# EAGLE schematic thermo_final (EAGLE 9.6.2)
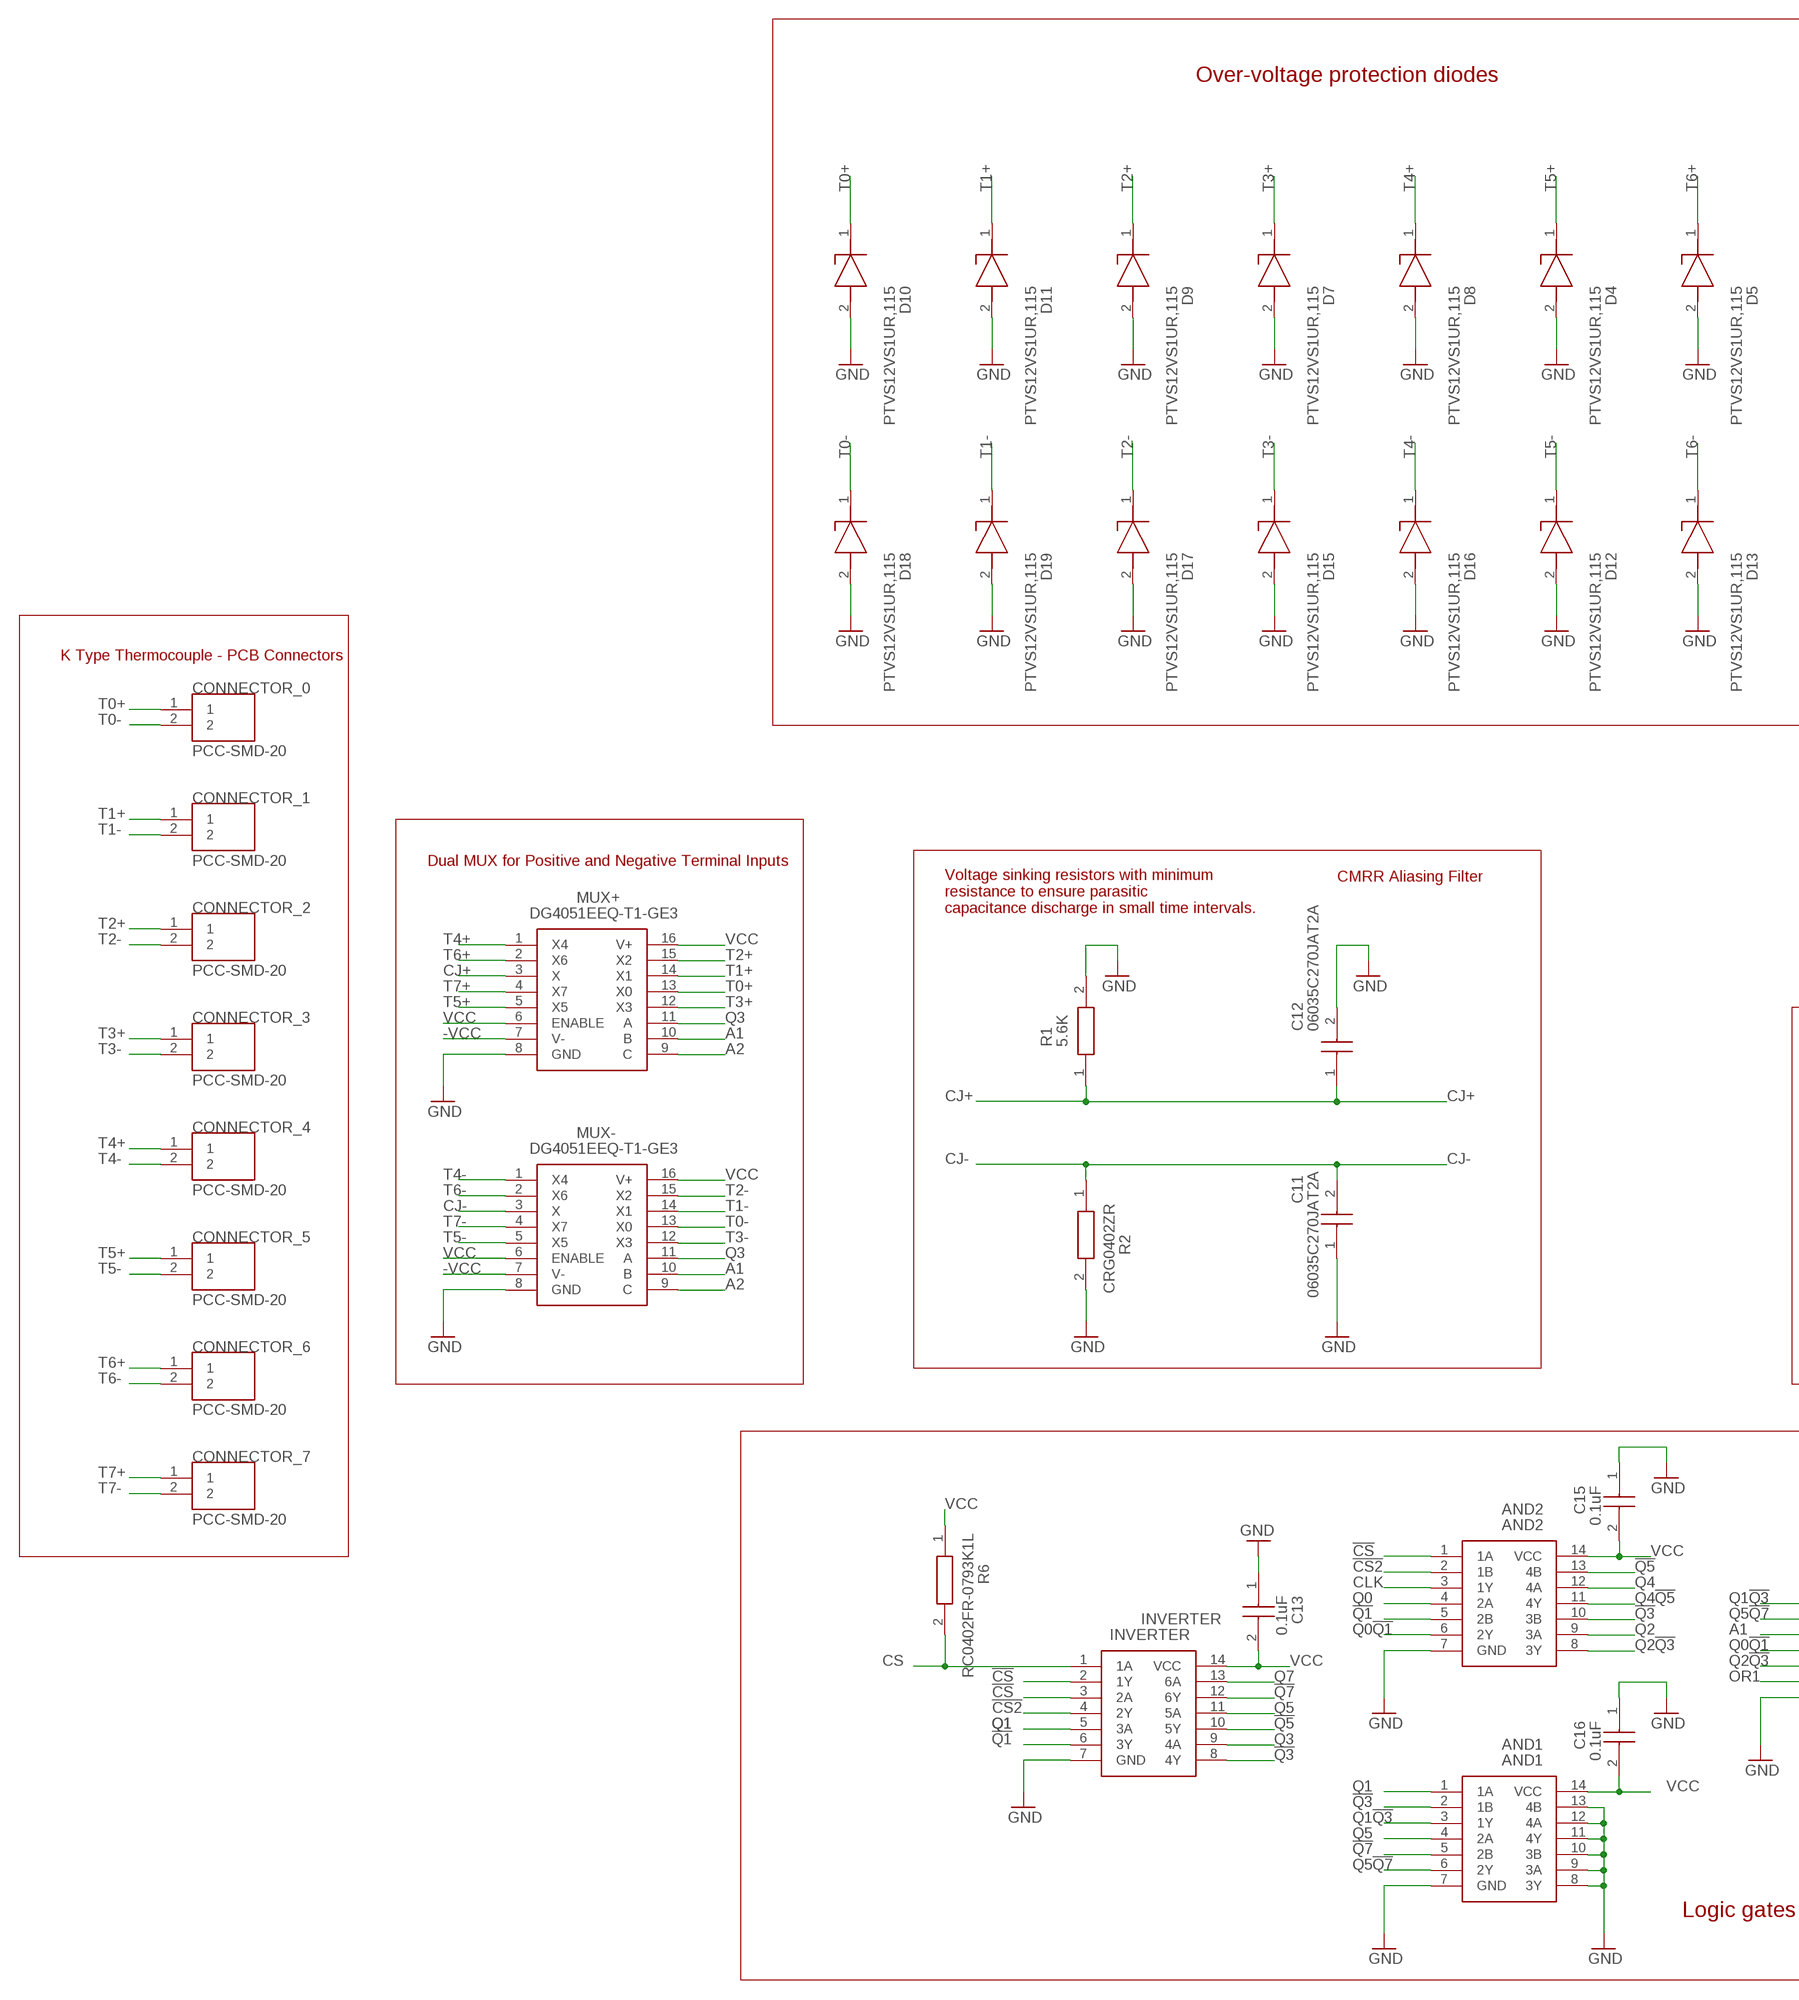
[diagram p0: schematic, sheet 1, part 1 of 2]
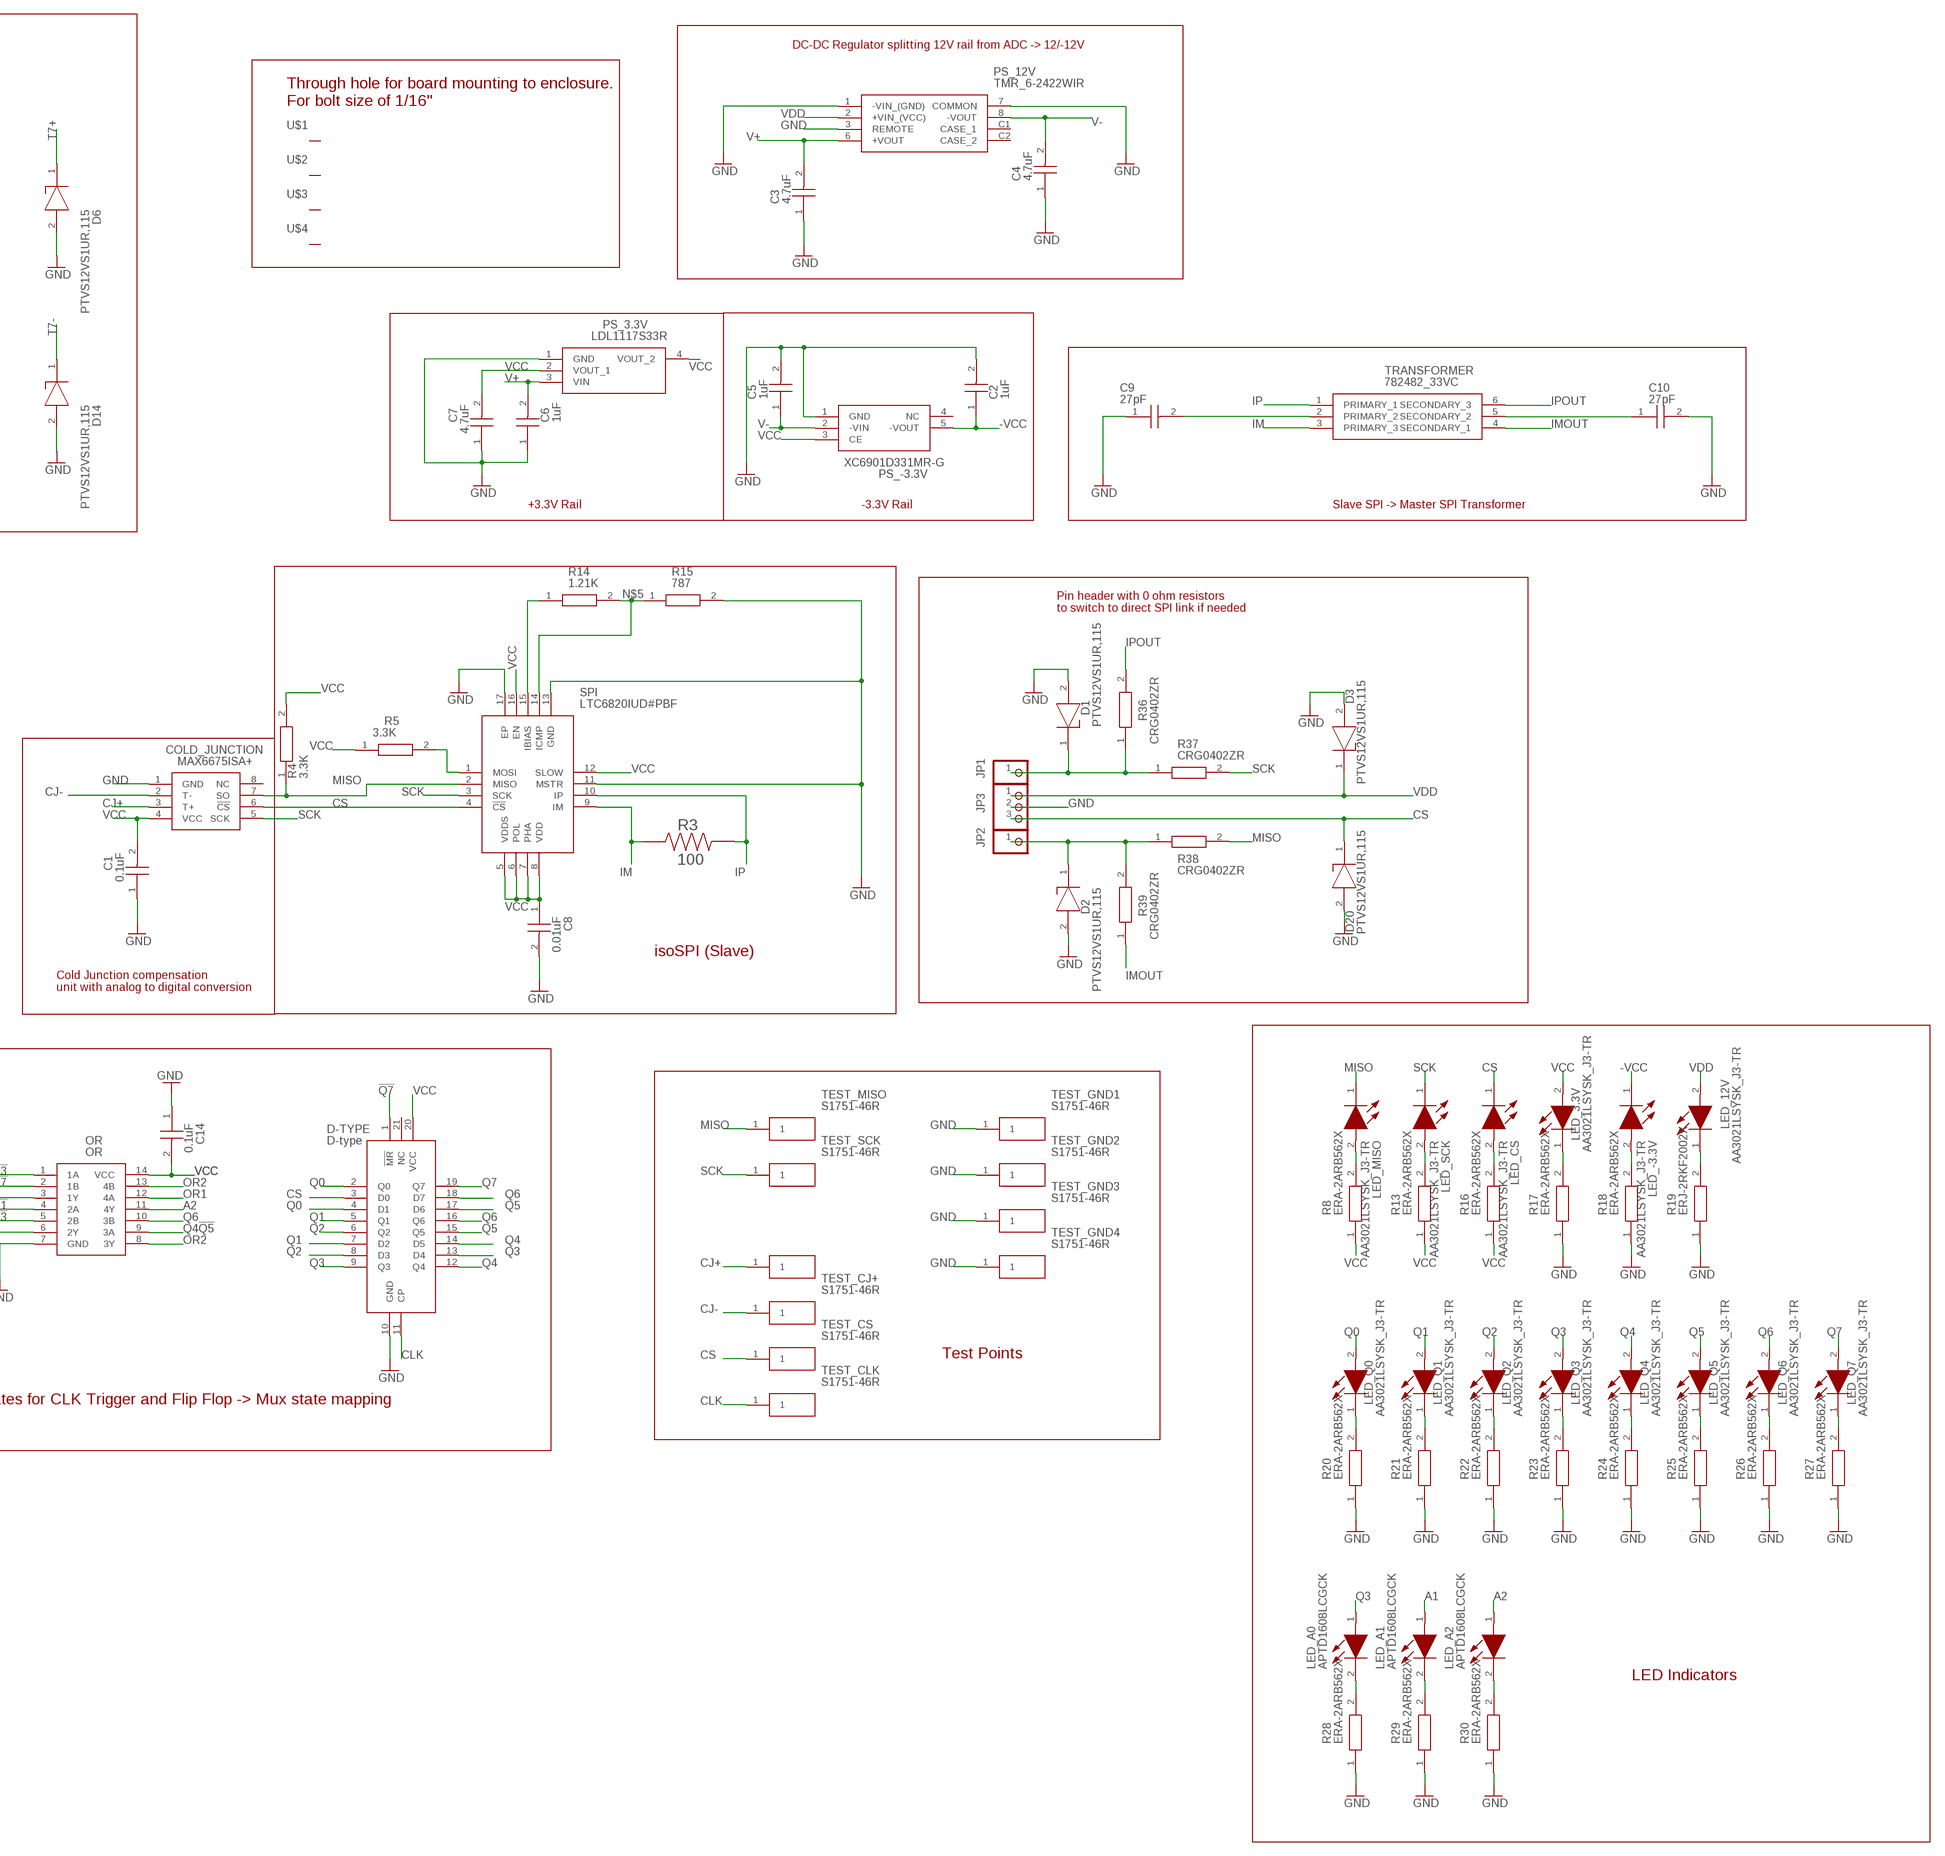
[diagram p1: schematic, sheet 1, part 2 of 2]

## Parts
AND1  AND1  SN74LVC08AMDREP  [SOIC127P600X175-14N]
AND2  AND2  SN74LVC08AMDREP  [SOIC127P600X175-14N]
C1  0.1uF  CGA3E2X7R1H104K080AE  [CAPC1608X90N]
C2  1uF  CGA3E1X7R1V105K080AC  [CAPC1608X90N]
C3  4.7uF  JMK107BB7475KA-T  [CAPC1608X90N]
C4  4.7uF  JMK107BB7475KA-T  [CAPC1608X90N]
C5  1uF  CGA3E1X7R1V105K080AC  [CAPC1608X90N]
C6  1uF  CGA3E1X7R1V105K080AC  [CAPC1608X90N]
C7  4.7uF  JMK107BB7475KA-T  [CAPC1608X90N]
C8  0.01uF  C0402C103J5RECAUTO  [CAPC1005X55N]
C9  27pF  06035C270JAT2A  [CAPC1608X90N]
C10  27pF  06035C270JAT2A  [CAPC1608X90N]
C11  06035C270JAT2A  [CAPC1608X90N]
C12  06035C270JAT2A  [CAPC1608X90N]
C13  0.1uF  CGA3E2X7R1H104K080AE  [CAPC1608X90N]
C14  0.1uF  CGA3E2X7R1H104K080AE  [CAPC1608X90N]
C15  0.1uF  CGA3E2X7R1H104K080AE  [CAPC1608X90N]
C16  0.1uF  CGA3E2X7R1H104K080AE  [CAPC1608X90N]
COLD_JUNCTION  MAX6675ISA+  [SOIC127P600X175-8N]
CONNECTOR_0  PCC-SMD-20  [OMEGA_PCC-SMD-20]
CONNECTOR_1  PCC-SMD-20  [OMEGA_PCC-SMD-20]
CONNECTOR_2  PCC-SMD-20  [OMEGA_PCC-SMD-20]
CONNECTOR_3  PCC-SMD-20  [OMEGA_PCC-SMD-20]
CONNECTOR_4  PCC-SMD-20  [OMEGA_PCC-SMD-20]
CONNECTOR_5  PCC-SMD-20  [OMEGA_PCC-SMD-20]
CONNECTOR_6  PCC-SMD-20  [OMEGA_PCC-SMD-20]
CONNECTOR_7  PCC-SMD-20  [OMEGA_PCC-SMD-20]
D1  PTVS12VS1UR,115  [SOD123W]
D2  PTVS12VS1UR,115  [SOD123W]
D3  PTVS12VS1UR,115  [SOD123W]
D4  PTVS12VS1UR,115  [SOD123W]
D5  PTVS12VS1UR,115  [SOD123W]
D6  PTVS12VS1UR,115  [SOD123W]
D7  PTVS12VS1UR,115  [SOD123W]
D8  PTVS12VS1UR,115  [SOD123W]
D9  PTVS12VS1UR,115  [SOD123W]
D10  PTVS12VS1UR,115  [SOD123W]
D11  PTVS12VS1UR,115  [SOD123W]
D12  PTVS12VS1UR,115  [SOD123W]
D13  PTVS12VS1UR,115  [SOD123W]
D14  PTVS12VS1UR,115  [SOD123W]
D15  PTVS12VS1UR,115  [SOD123W]
D16  PTVS12VS1UR,115  [SOD123W]
D17  PTVS12VS1UR,115  [SOD123W]
D18  PTVS12VS1UR,115  [SOD123W]
D19  PTVS12VS1UR,115  [SOD123W]
D20  PTVS12VS1UR,115  [SOD123W]
D-TYPE  D-type  74AHC273BQ,115  [QFN50P450X250X100-21N]
INVERTER  INVERTER  SN74HCS05QDRQ1  [SOIC127P600X175-14N]
JP1  PINHD-1X1  [1X01]
JP2  PINHD-1X1  [1X01]
JP3  PINHD-1X3  [1X03]
LED_3.3V  AA3021LSYSK_J3-TR  [AA3021LSYSKJ3TR]
LED_12V  AA3021LSYSK_J3-TR  [AA3021LSYSKJ3TR]
LED_-3.3V  AA3021LSYSK_J3-TR  [AA3021LSYSKJ3TR]
LED_A0  APTD1608LCGCK  [APT1608CGCK]
LED_A1  APTD1608LCGCK  [APT1608CGCK]
LED_A2  APTD1608LCGCK  [APT1608CGCK]
LED_CS  AA3021LSYSK_J3-TR  [AA3021LSYSKJ3TR]
LED_MISO  AA3021LSYSK_J3-TR  [AA3021LSYSKJ3TR]
LED_Q0  AA3021LSYSK_J3-TR  [AA3021LSYSKJ3TR]
LED_Q1  AA3021LSYSK_J3-TR  [AA3021LSYSKJ3TR]
LED_Q2  AA3021LSYSK_J3-TR  [AA3021LSYSKJ3TR]
LED_Q3  AA3021LSYSK_J3-TR  [AA3021LSYSKJ3TR]
LED_Q4  AA3021LSYSK_J3-TR  [AA3021LSYSKJ3TR]
LED_Q5  AA3021LSYSK_J3-TR  [AA3021LSYSKJ3TR]
LED_Q6  AA3021LSYSK_J3-TR  [AA3021LSYSKJ3TR]
LED_Q7  AA3021LSYSK_J3-TR  [AA3021LSYSKJ3TR]
LED_SCK  AA3021LSYSK_J3-TR  [AA3021LSYSKJ3TR]
MUX+  DG4051EEQ-T1-GE3  [SOP65P640X120-16N]
MUX-  DG4051EEQ-T1-GE3  [SOP65P640X120-16N]
OR  OR  SN74LV32ADE4  [SOIC127P600X175-14N]
PS_3.3V  LDL1117S33R  [SOT230P700X180-4N]
PS_12V  TMR_6-2422WIR  [TMR67212WIR]
PS_-3.3V  XC6901D331MR-G  [SOT95P280X130-5N]
R1  5.6K  ERA-2ARB562X  [ERA2AED122X]
R2  CRG0402ZR  [RESC1005X40N]
R3  100  TNPW0402100RBYEP  [RESC1005X40N]
R4  3.3K  RC0402JR-133K3L  [RESC1005X40N]
R5  3.3K  RC0402JR-133K3L  [RESC1005X40N]
R6  RC0402FR-0793K1L  [RESC1005X40N]
R8  ERA-2ARB562X  [ERA2AED122X]
R13  ERA-2ARB562X  [ERA2AED122X]
R14  1.21K  CPF0402B1K21E1  [RESC1005X35N]
R15  787  ERA-2AEB7870X  [ERA2AED122X]
R16  ERA-2ARB562X  [ERA2AED122X]
R17  ERA-2ARB562X  [ERA2AED122X]
R18  ERA-2ARB562X  [ERA2AED122X]
R19  ERJ-2RKF2002X  [ERJ2R_(0402)]
R20  ERA-2ARB562X  [ERA2AED122X]
R21  ERA-2ARB562X  [ERA2AED122X]
R22  ERA-2ARB562X  [ERA2AED122X]
R23  ERA-2ARB562X  [ERA2AED122X]
R24  ERA-2ARB562X  [ERA2AED122X]
R25  ERA-2ARB562X  [ERA2AED122X]
R26  ERA-2ARB562X  [ERA2AED122X]
R27  ERA-2ARB562X  [ERA2AED122X]
R28  ERA-2ARB562X  [ERA2AED122X]
R29  ERA-2ARB562X  [ERA2AED122X]
R30  ERA-2ARB562X  [ERA2AED122X]
R36  CRG0402ZR  [RESC1005X40N]
R37  CRG0402ZR  [RESC1005X40N]
R38  CRG0402ZR  [RESC1005X40N]
R39  CRG0402ZR  [RESC1005X40N]
SPI  LTC6820IUD#PBF  [QFN50P300X300X80-17N]
TEST_CJ+  S1751-46R  [S175146R]
TEST_CJ-  S1751-46R  [S175146R]
TEST_CLK  S1751-46R  [S175146R]
TEST_CS  S1751-46R  [S175146R]
TEST_GND1  S1751-46R  [S175146R]
TEST_GND2  S1751-46R  [S175146R]
TEST_GND3  S1751-46R  [S175146R]
TEST_GND4  S1751-46R  [S175146R]
TEST_MISO  S1751-46R  [S175146R]
TEST_SCK  S1751-46R  [S175146R]
TRANSFORMER  782482_33VC  [DIP1016W60P254L914H635Q6N]
U$1  THROUGH_HOLE  [THROUGH_HOLE]
U$2  THROUGH_HOLE  [THROUGH_HOLE]
U$3  THROUGH_HOLE  [THROUGH_HOLE]
U$4  THROUGH_HOLE  [THROUGH_HOLE]

## Nets
!CS: AND2.1(1A) INVERTER.2(1Y) INVERTER.3(2A)
!CS2: AND2.2(1B) INVERTER.4(2Y)
!Q1: AND2.5(2B) INVERTER.6(3Y)
!Q3: AND1.2(1B) AND2.10(3B) INVERTER.8(4Y)
!Q5: AND2.13(4B) INVERTER.10(5Y)
!Q7: AND1.5(2B) D-TYPE.1(!MR) INVERTER.12(6Y)
-VCC: C2.1 LED_-3.3V.1(K) MUX+.7(V-) MUX-.7(V-) PS_-3.3V.5(-VOUT)
A1: LED_A1.1(A) MUX+.10(B) MUX-.10(B) OR.3(1Y)
A2: LED_A2.1(A) MUX+.9(C) MUX-.9(C) OR.11(4Y)
CJ+: C12.1 COLD_JUNCTION.3(T+) MUX+.3(X) R1.1 TEST_CJ-.1
CJ-: C11.2 COLD_JUNCTION.2(T-) MUX-.3(X) R2.1 TEST_CJ+.1
CLK: AND2.3(1Y) D-TYPE.11(CP) TEST_CLK.1
CS: COLD_JUNCTION.6(!CS) D20.1(K) D-TYPE.3(D0) INVERTER.1(1A) JP3.3 LED_CS.1(K) R6.2 SPI.4(!CS) TEST_CS.1
GND: AND1.7(GND) AND1.8(3Y) AND1.9(3A) AND1.10(3B) AND1.11(4Y) AND1.12(4A) AND1.13(4B) AND2.7(GND) C1.1 C2.2 C3.1 C4.1 C5.2 C6.1 C7.1 C8.2 C9.1 C10.2 C11.1 C12.2 C13.1 C14.1 C15.1 C16.1 COLD_JUNCTION.1(GND) D1.2(A) D2.2(A) D3.2(A) D4.2(A) D5.2(A) D6.2(A) D7.2(A) D8.2(A) D9.2(A) D10.2(A) D11.2(A) D12.2(A) D13.2(A) D14.2(A) D15.2(A) D16.2(A) D17.2(A) D18.2(A) D19.2(A) D20.2(A) D-TYPE.10(GND) INVERTER.7(GND) JP3.2 MUX+.8(GND) MUX-.8(GND) OR.7(GND) PS_3.3V.1(GND) PS_12V.1(-VIN_(GND)) PS_12V.3(REMOTE) PS_12V.7(COMMON) PS_-3.3V.1(GND) R1.2 R2.2 R15.2 R17.1 R18.1 R19.1 R20.1 R21.1 R22.1 R23.1 R24.1 R25.1 R26.1 R27.1 R28.1 R29.1 R30.1 SPI.11(MSTR) SPI.13(GND) SPI.17(EP) TEST_GND1.1 TEST_GND2.1 TEST_GND3.1 TEST_GND4.1
IM: R3.1 SPI.9(IM) TRANSFORMER.3(PRIMARY_3)
IMOUT: R39.1 TRANSFORMER.4(SECONDARY_1)
IP: R3.2 SPI.10(IP) TRANSFORMER.1(PRIMARY_1)
IPOUT: R36.2 TRANSFORMER.6(SECONDARY_3)
MISO: COLD_JUNCTION.7(SO) LED_MISO.1(K) R4.1 R38.2 SPI.2(MISO) TEST_MISO.1
N$2: LED_12V.1(K) R19.2
N$5: R14.2 R15.1 SPI.14(ICMP)
N$7: LED_Q0.1(K) R20.2
N$10: C9.2 TRANSFORMER.2(PRIMARY_2)
N$11: R14.1 SPI.15(IBIAS)
N$12: LED_Q1.1(K) R21.2
N$14: C10.1 TRANSFORMER.5(SECONDARY_2)
N$16: LED_Q2.1(K) R22.2
N$17: LED_Q3.1(K) R23.2
N$20: LED_MISO.2(A) R8.2
N$22: R5.2 SPI.1(MOSI)
N$23: LED_SCK.2(A) R13.2
N$24: LED_CS.2(A) R16.2
N$25: LED_3.3V.1(K) R17.2
N$26: LED_-3.3V.2(A) R18.2
N$27: LED_Q4.1(K) R24.2
N$28: LED_Q5.1(K) R25.2
N$29: LED_Q6.1(K) R26.2
N$30: LED_Q7.1(K) R27.2
N$34: LED_A0.2(K) R28.2
N$35: LED_A1.2(K) R29.2
N$36: LED_A2.2(K) R30.2
N$37: D1.1(K) JP1.1 R36.1 R37.1
N$40: D2.1(K) JP2.1 R38.1 R39.2
OR1: OR.6(2Y) OR.12(4A)
OR2: OR.8(3Y) OR.13(4B)
Q0: AND2.4(2A) D-TYPE.2(Q0) D-TYPE.4(D1) LED_Q0.2(A)
Q0!Q1: AND2.6(2Y) OR.4(2A)
Q1: AND1.1(1A) D-TYPE.5(Q1) D-TYPE.7(D2) INVERTER.5(3A) LED_Q1.2(A)
Q1!Q3: AND1.3(1Y) OR.1(1A)
Q2: AND2.9(3A) D-TYPE.6(Q2) D-TYPE.8(D3) LED_Q2.2(A)
Q2!Q3: AND2.8(3Y) OR.5(2B)
Q3: D-TYPE.9(Q3) D-TYPE.13(D4) INVERTER.9(4A) LED_A0.1(A) LED_Q3.2(A) MUX+.11(A) MUX-.11(A)
Q4: AND2.12(4A) D-TYPE.12(Q4) D-TYPE.14(D5) LED_Q4.2(A)
Q4!Q5: AND2.11(4Y) OR.9(3A)
Q5: AND1.4(2A) D-TYPE.15(Q5) D-TYPE.17(D6) INVERTER.11(5A) LED_Q5.2(A)
Q5!Q7: AND1.6(2Y) OR.2(1B)
Q6: D-TYPE.16(Q6) D-TYPE.18(D7) LED_Q6.2(A) OR.10(3B)
Q7: D-TYPE.19(Q7) INVERTER.13(6A) LED_Q7.2(A)
SCK: COLD_JUNCTION.5(SCK) LED_SCK.1(K) R37.2 SPI.3(SCK) TEST_SCK.1
T0+: CONNECTOR_0.1 D10.1(K) MUX+.13(X0)
T0-: CONNECTOR_0.2 D18.1(K) MUX-.13(X0)
T1+: CONNECTOR_1.1 D11.1(K) MUX+.14(X1)
T1-: CONNECTOR_1.2 D19.1(K) MUX-.14(X1)
T2+: CONNECTOR_2.1 D9.1(K) MUX+.15(X2)
T2-: CONNECTOR_2.2 D17.1(K) MUX-.15(X2)
T3+: CONNECTOR_3.1 D7.1(K) MUX+.12(X3)
T3-: CONNECTOR_3.2 D15.1(K) MUX-.12(X3)
T4+: CONNECTOR_4.1 D8.1(K) MUX+.1(X4)
T4-: CONNECTOR_4.2 D16.1(K) MUX-.1(X4)
T5+: CONNECTOR_5.1 D4.1(K) MUX+.5(X5)
T5-: CONNECTOR_5.2 D12.1(K) MUX-.5(X5)
T6+: CONNECTOR_6.1 D5.1(K) MUX+.2(X6)
T6-: CONNECTOR_6.2 D13.1(K) MUX-.2(X6)
T7+: CONNECTOR_7.1 D6.1(K) MUX+.4(X7)
T7-: CONNECTOR_7.2 D14.1(K) MUX-.4(X7)
V+: C3.2 C6.2 PS_3.3V.3(VIN) PS_12V.6(+VOUT)
V-: C4.2 C5.1 PS_12V.8(-VOUT) PS_-3.3V.2(-VIN)
VCC: AND1.14(VCC) AND2.14(VCC) C1.2 C7.2 C8.1 C13.2 C14.2 C15.2 C16.2 COLD_JUNCTION.4(VCC) D-TYPE.20(VCC) INVERTER.14(VCC) LED_3.3V.2(A) MUX+.6(ENABLE) MUX+.16(V+) MUX-.6(ENABLE) MUX-.16(V+) OR.14(VCC) PS_3.3V.2(VOUT_1) PS_3.3V.4(VOUT_2) PS_-3.3V.3(CE) R4.2 R5.1 R6.1 R8.1 R13.1 R16.1 SPI.5(VDDS) SPI.6(POL) SPI.7(PHA) SPI.8(VDD) SPI.12(SLOW) SPI.16(EN)
VDD: D3.1(K) JP3.1 LED_12V.2(A) PS_12V.2(+VIN_(VCC))
Unconnected: COLD_JUNCTION.8(NC) D-TYPE.21(NC) PS_12V.C1(CASE_1) PS_12V.C2(CASE_2) PS_-3.3V.4(NC) U$1.THROUGH_HOLE U$2.THROUGH_HOLE U$3.THROUGH_HOLE U$4.THROUGH_HOLE

## Notes on the sheet
- DC-DC Regulator splitting 12V rail from ADC -> 12/-12V
- Over-voltage protection diodes
- Through hole for board mounting to enclosure.
  For bolt size of 1/16"
- K Type Thermocouple - PCB Connectors
- +3.3V Rail | -3.3V Rail | Slave SPI -> Master SPI Transformer
- Pin header with 0 ohm resistors
  to switch to direct SPI link if needed
- Dual MUX for Positive and Negative Terminal Inputs
- CMRR Aliasing Filter
- Voltage sinking resistors with minimum
  resistance to ensure parasitic 
  capacitance discharge in small time intervals.
- isoSPI (Slave)
- Cold Junction compensation 
  unit with analog to digital conversion
- Test Points
- Logic gates for CLK Trigger and Flip Flop -> Mux state mapping
- LED Indicators

## Library data of the parts
AND1 AND2 = SamacSys_Parts:SN74LVC08AMDREP: Enhanced Product Quadruple 2-Input Positive-And Gate Source: Datasheet <http://www.ti.com/lit/gpn/sn74lvc08a-ep>; DESCRIPTION: Enhanced Product Quadruple 2-Input Positive-And Gate; HEIGHT: 1.75mm; MANUFACTURER_NAME: Texas Instruments; MANUFACTURER_PART_NUMBER: SN74LVC08AMDREP; MOUSER_PART_NUMBER: 595-SN74LVC08AMDREP; MOUSER_PRICE-STOCK: https://www.mouser.co.uk/ProductDetail/Texas-Instruments/SN74LVC08AMDREP?qs=IUbkBnfnSQJ8S345Etgw0g%3D%3D
C1 C13-C16 = SamacSys_Parts:CGA3E2X7R1H104K080AE: Multilayer Ceramic Chip Capacitors, Capacitance=0.1uF, LxWxT:1.6x0.8x0.8mm Source: Datasheet <https://product.tdk.com/system/files/dam/doc/product/capacitor/ceramic/mlcc/catalog/mlcc_automotive_soft_en.pdf>; DESCRIPTION: Multilayer Ceramic Chip Capacitors, Capacitance=0.1uF, LxWxT:1.6x0.8x0.8mm; HEIGHT: 0.9mm; MANUFACTURER_NAME: TDK; MANUFACTURER_PART_NUMBER: CGA3E2X7R1H104K080AE; MOUSER_PART_NUMBER: 810-CGA3E2X7R1H104KE; MOUSER_PRICE-STOCK: https://www.mouser.co.uk/ProductDetail/TDK/CGA3E2X7R1H104K080AE?qs=n%2FVzw7c4a0kvajqFvEbDzQ%3D%3D
C2 C5 C6 = SamacSys_Parts:CGA3E1X7R1V105K080AC: Multilayer Ceramic Capacitors MLCC - SMD/SMT 0603 1uF 35volts X7R 10% T=0.8mm Source: Datasheet <https://product.tdk.com/system/files/dam/doc/product/capacitor/ceramic/mlcc/catalog/mlcc_automotive_general_en.pdf>; DESCRIPTION: Multilayer Ceramic Capacitors MLCC - SMD/SMT 0603 1uF 35volts X7R 10% T=0.8mm; HEIGHT: 0.9mm; MANUFACTURER_NAME: TDK; MANUFACTURER_PART_NUMBER: CGA3E1X7R1V105K080AC; MOUSER_PART_NUMBER: 810-CGA3E1X7R1V105KC; MOUSER_PRICE-STOCK: https://www.mouser.co.uk/ProductDetail/TDK/CGA3E1X7R1V105K080AC?qs=xLDY6iXSiQbKOisZZVHFrA%3D%3D
C3 C4 C7 = SamacSys_Parts:JMK107BB7475KA-T: Taiyo Yuden JMK107BB7475KA-T 4.7F MLCC 6.3V dc +/-10% Tolerance SMD Source: Datasheet <https://componentsearchengine.com/Datasheets/1/JMK107BB7475KA-T.pdf>; DESCRIPTION: Taiyo Yuden JMK107BB7475KA-T 4.7F MLCC 6.3V dc +/-10% Tolerance SMD; HEIGHT: 0.9mm; MANUFACTURER_NAME: TAIYO YUDEN; MANUFACTURER_PART_NUMBER: JMK107BB7475KA-T; MOUSER_PART_NUMBER: 963-JMK107BB7475KA-T; MOUSER_PRICE-STOCK: https://www.mouser.co.uk/ProductDetail/Taiyo-Yuden/JMK107BB7475KA-T/?qs=Va%252BXcMGJzEswq6AuVGoq3Q%3D%3D
C8 = SamacSys_Parts:C0402C103J5RECAUTO: Multilayer Ceramic Capacitors MLCC - SMD/SMT 50V 0.01uF X7R 0402 5% AEC-Q200 Source: Datasheet <https://componentsearchengine.com/Datasheets/1/C0402C103J5RECAUTO.pdf>; DESCRIPTION: Multilayer Ceramic Capacitors MLCC - SMD/SMT 50V 0.01uF X7R 0402 5% AEC-Q200; HEIGHT: 0.55mm; MANUFACTURER_NAME: Kemet; MANUFACTURER_PART_NUMBER: C0402C103J5RECAUTO; MOUSER_PART_NUMBER: 80-C0402C103J5RECAUT; MOUSER_PRICE-STOCK: https://www.mouser.com/Search/Refine.aspx?Keyword=80-C0402C103J5RECAUT
C9-C12 = SamacSys_Parts:06035C270JAT2A: Capacitor, 0603 27PF +/-5% 50V Source: Datasheet <https://componentsearchengine.com/Datasheets/1/06031A100FAT2A.pdf>; DESCRIPTION: Capacitor, 0603 27PF +/-5% 50V; HEIGHT: 0.9mm; MANUFACTURER_NAME: AVX; MANUFACTURER_PART_NUMBER: 06035C270JAT2A
COLD_JUNCTION = SamacSys_Parts:MAX6675ISA+: MAX6675ISA+, 12bit Temperature Sensor +/-6C Serial-SPI 3 to 5.5V 8-Pin SOIC Source: Datasheet <http://datasheets.maximintegrated.com/en/ds/MAX6675.pdf>; DESCRIPTION: MAX6675ISA+, 12bit Temperature Sensor +/-6C Serial-SPI 3 to 5.5V 8-Pin SOIC; HEIGHT: 1.75mm; MANUFACTURER_NAME: Maxim Integrated; MANUFACTURER_PART_NUMBER: MAX6675ISA+; MOUSER_PART_NUMBER: 700-MAX6675ISA; MOUSER_PRICE-STOCK: https://www.mouser.co.uk/ProductDetail/Maxim-Integrated/MAX6675ISA%2b?qs=1THa7WoU59H74vpgspkIMw%3D%3D
CONNECTOR_0 CONNECTOR_1-CONNECTOR_7 = SamacSys_Parts:PCC-SMD-20: Circuit Board Thermocouple Connectors For Miniature Connectors Check availability <https://pricing.snapeda.com/parts/PCC-SMD-20/Omega%20Engineering/view-part?ref=eda>; AVAILABILITY: In Stock; DESCRIPTION: Circuit Board Thermocouple Connectors For Miniature Connectors; MF: Omega Engineering; MP: PCC-SMD-20; PACKAGE: Package; PRICE: None
D1-D20 = SamacSys_Parts:PTVS12VS1UR,115: PTVSxS1UR series - 400 W Transient Voltage Suppressor Source: Datasheet <https://assets.nexperia.com/documents/data-sheet/PTVSXS1UR_SER.pdf>; DESCRIPTION: PTVSxS1UR series - 400 W Transient Voltage Suppressor; HEIGHT: mm; MANUFACTURER_NAME: Nexperia; MANUFACTURER_PART_NUMBER: PTVS12VS1UR,115; MOUSER_PART_NUMBER: 771-PTVS12VS1UR115; MOUSER_PRICE-STOCK: https://www.mouser.co.uk/ProductDetail/Nexperia/PTVS12VS1UR115?qs=LMSg3oBIm%2FiWSHvsyxWiLg%3D%3D
D-TYPE = SamacSys_Parts:74AHC273BQ,115: 74AHC(T)273 - Octal D-type flip-flop with reset; positive-edge trigger@en-us Source: Datasheet <https://assets.nexperia.com/documents/data-sheet/74AHC_AHCT273.pdf>; DESCRIPTION: 74AHC(T)273 - Octal D-type flip-flop with reset; positive-edge trigger@en-us; HEIGHT: 1mm; MANUFACTURER_NAME: Nexperia; MANUFACTURER_PART_NUMBER: 74AHC273BQ,115; MOUSER_PART_NUMBER: 771-AHC273BQ115; MOUSER_PRICE-STOCK: https://www.mouser.co.uk/ProductDetail/Nexperia/74AHC273BQ115?qs=P62ublwmbi%2FNeDtynP3YzQ%3D%3D
INVERTER = SamacSys_Parts:SN74HCS05QDRQ1: Inverters Automotive hex inverters with open-drain outputs Source: Datasheet <https://datasheet.datasheetarchive.com/originals/distributors/Datasheets_SAMA/e44fd63c1eea9119ffad112a4354263c.pdf>; DESCRIPTION: Inverters Automotive hex inverters with open-drain outputs; HEIGHT: 1.75mm; MANUFACTURER_NAME: Texas Instruments; MANUFACTURER_PART_NUMBER: SN74HCS05QDRQ1; MOUSER_PART_NUMBER: 595-SN74HCS05QDRQ1; MOUSER_PRICE-STOCK: https://www.mouser.co.uk/ProductDetail/Texas-Instruments/SN74HCS05QDRQ1?qs=wnTfsH77Xs5yXbtYXA5ARw%3D%3D
JP1 JP2 = pinhead:PINHD-1X1: PIN HEADER
JP3 = pinhead:PINHD-1X3: PIN HEADER
LED_3.3V LED_12V LED_-3.3V LED_CS LED_MISO LED_Q0 LED_Q1-LED_Q7 LED_SCK = SamacSys_Parts:AA3021LSYSK_J3-TR: Standard LEDs - SMD 3mmX2mm SMD LED LAMP SB YELLOW Source: Datasheet <https://eagle.componentsearchengine.com/Datasheets/1/AA3021LSYSK_J3-TR.pdf>; DESCRIPTION: Standard LEDs - SMD 3mmX2mm SMD LED LAMP SB YELLOW; HEIGHT: 1.3mm; MANUFACTURER_NAME: Kingbright; MANUFACTURER_PART_NUMBER: AA3021LSYSK/J3-TR; MOUSER_PART_NUMBER: 604-AA3021LSYSK/J3TR; MOUSER_PRICE-STOCK: https://www.mouser.co.uk/ProductDetail/Kingbright/AA3021LSYSK-J3-TR?qs=Oo40KB9lBTmS1V8p5PSO3Q%3D%3D
LED_A0 LED_A1 LED_A2 = SamacSys_Parts:APTD1608LCGCK: Standard LEDs - SMD 0603 Dome Lens LED Green- 570nm Source: Datasheet; DESCRIPTION: Standard LEDs - SMD 0603 Dome Lens LED Green- 570nm; HEIGHT: mm; MANUFACTURER_NAME: Kingbright; MANUFACTURER_PART_NUMBER: APTD1608LCGCK; MOUSER_PART_NUMBER: 604-APTD1608LCGCK; MOUSER_PRICE-STOCK: https://www.mouser.co.uk/ProductDetail/Kingbright/APTD1608LCGCK?qs=AQlKX63v8Rv%252Bp7eo1xBjCA%3D%3D
MUX+ MUX- = SamacSys_Parts:DG4051EEQ-T1-GE3: VISHAY - DG4051EEQ-T1-GE3 - ANALOGUE MUX, 1 CH, 8:1, TSSOP-16 Source: Datasheet <https://www.vishay.com/docs/69685/dg4051e.pdf>; DESCRIPTION: VISHAY - DG4051EEQ-T1-GE3 - ANALOGUE MUX, 1 CH, 8:1, TSSOP-16; HEIGHT: 1.2mm; MANUFACTURER_NAME: Vishay; MANUFACTURER_PART_NUMBER: DG4051EEQ-T1-GE3; MOUSER_PART_NUMBER: 78-DG4051EEQ-T1-GE3; MOUSER_PRICE-STOCK: https://www.mouser.co.uk/ProductDetail/Vishay-Siliconix/DG4051EEQ-T1-GE3?qs=367PjNmvCmmPtnHZ5hoXyA%3D%3D
OR = SamacSys_Parts:SN74LV32ADE4: Logic Gates Quadruple 2-Input Positive-OR Gates Source: Datasheet <https://www.ti.com/lit/gpn/sn74lv32a>; DESCRIPTION: Logic Gates Quadruple 2-Input Positive-OR Gates; HEIGHT: 1.75mm; MANUFACTURER_NAME: Texas Instruments; MANUFACTURER_PART_NUMBER: SN74LV32ADE4; MOUSER_PART_NUMBER: 595-SN74LV32ADE4; MOUSER_PRICE-STOCK: https://www.mouser.co.uk/ProductDetail/Texas-Instruments/SN74LV32ADE4?qs=UG%2F8xqv%2F6Wd6nyqQSVzDrA%3D%3D
PS_3.3V = SamacSys_Parts:LDL1117S33R: STMICROELECTRONICS - LDL1117S33R - LDO, FIXED, 3.3V, 1.2A, SOT-223-3 Source: Datasheet <https://componentsearchengine.com/Datasheets/2/LDL1117S33R.pdf>; DESCRIPTION: STMICROELECTRONICS - LDL1117S33R - LDO, FIXED, 3.3V, 1.2A, SOT-223-3; HEIGHT: 1.8mm; MANUFACTURER_NAME: STMicroelectronics; MANUFACTURER_PART_NUMBER: LDL1117S33R; MOUSER_PART_NUMBER: 511-LDL1117S33R; MOUSER_PRICE-STOCK: https://www.mouser.co.uk/ProductDetail/STMicroelectronics/LDL1117S33R?qs=AQlKX63v8Rt9Bf6AWSrbFg%3D%3D
PS_12V = SamacSys_Parts:TMR_6-2422WIR: 6 Watt DC/DC converter, railway, 4:1 input incl. 110 VDC nominal, regulated, 3000 VDC I/O-isolation, encapsulated, SIP-8 metal case Source: Datasheet <https://tracopower.com/tmr6wir-datasheet/>; DESCRIPTION: 6 Watt DC/DC converter, railway, 4:1 input incl. 110 VDC nominal, regulated, 3000 VDC I/O-isolation, encapsulated, SIP-8 metal case; HEIGHT: 11.7mm; MANUFACTURER_NAME: Traco Power; MANUFACTURER_PART_NUMBER: TMR 6-2422WIR; MOUSER_PART_NUMBER: 495-TMR6-2422WIR; MOUSER_PRICE-STOCK: https://www.mouser.co.uk/ProductDetail/TRACO-Power/TMR-6-2422WIR?qs=y6ZabgHbY%252BxPUL%252BjE2kWEQ%3D%3D
PS_-3.3V = SamacSys_Parts:XC6901D331MR-G: TOREX - XC6901D331MR-G - LDO Voltage Regulator, Fixed, -12.4 V to -2.4 V in, 102 mV Drop, -3.3 V/200 mA out, SOT-25-5 Source: Datasheet <https://ms.componentsearchengine.com/Datasheets/2/XC6901D331MR-G.pdf>; DESCRIPTION: TOREX - XC6901D331MR-G - LDO Voltage Regulator, Fixed, -12.4 V to -2.4 V in, 102 mV Drop, -3.3 V/200 mA out, SOT-25-5; HEIGHT: 1.3mm; MANUFACTURER_NAME: Torex; MANUFACTURER_PART_NUMBER: XC6901D331MR-G; MOUSER_PART_NUMBER: 865-XC6901D331MR-G; MOUSER_PRICE-STOCK: https://www.mouser.co.uk/ProductDetail/Torex-Semiconductor/XC6901D331MR-G/?qs=AsjdqWjXhJ%2FQIk2kdQmgqw%3D%3D
R1 R8 R13 R16-R18 R20-R30 = SamacSys_Parts:ERA-2ARB562X: Metal Thin Film Chip Resistor, 0402, 0.063W Source: Datasheet <https://componentsearchengine.com/Datasheets/1/ERA-2ARB562X.pdf>; DESCRIPTION: Metal Thin Film Chip Resistor, 0402, 0.063W; HEIGHT: 0.4mm; MANUFACTURER_NAME: Panasonic; MANUFACTURER_PART_NUMBER: ERA-2ARB562X; MOUSER_PART_NUMBER: 667-ERA-2ARB562X; MOUSER_PRICE-STOCK: https://www.mouser.com/Search/Refine.aspx?Keyword=667-ERA-2ARB562X
R2 R36-R39 = SamacSys_Parts:CRG0402ZR: 0 0402 Thick Film Surface Mount Fixed Resistor +/-0% 0.063W CRG0402ZR Source: Datasheet <https://www.te.com/commerce/DocumentDelivery/DDEController?Action=showdoc&DocId=Data Sheet1773204JpdfEnglishENG_DS_1773204_J.pdf6-1622826-4>; DESCRIPTION: 0 0402 Thick Film Surface Mount Fixed Resistor +/-0% 0.063W CRG0402ZR; HEIGHT: 0.4mm; MANUFACTURER_NAME: TE Connectivity; MANUFACTURER_PART_NUMBER: CRG0402ZR; MOUSER_PART_NUMBER: 279-CRG0402ZR; MOUSER_PRICE-STOCK: https://www.mouser.co.uk/ProductDetail/TE-Connectivity-Holsworthy/CRG0402ZR?qs=n4i9pByFsMS7bfq5JAG5yw%3D%3D
R3 = SamacSys_Parts:TNPW0402100RBYEP: Check availability <https://pricing.snapeda.com/parts/TNPW0402100RBYEP/Vishay/view-part?ref=eda>; AVAILABILITY: In Stock; DESCRIPTION: 100 Ohms ±0.1% 0.063W, 1/16W Chip Resistor 0402 (1005 Metric) Anti-Sulfur, Automotive AEC-Q200, Moisture Resistant Thin Film; MF: Vishay; MP: TNPW0402100RBYEP; PACKAGE: 1005 Stackpole; PRICE: None; PURCHASE-URL: https://pricing.snapeda.com/search/part/TNPW0402100RBYEP/?ref=eda
R4 R5 = SamacSys_Parts:RC0402JR-133K3L: Thick Film Resistors - SMD 3.3K ohm 5% 50V General Purpose Source: Datasheet; DESCRIPTION: Thick Film Resistors - SMD 3.3K ohm 5% 50V General Purpose; HEIGHT: 0.4mm; MANUFACTURER_NAME: YAGEO (PHYCOMP); MANUFACTURER_PART_NUMBER: RC0402JR-133K3L; MOUSER_PART_NUMBER: 603-RC0402JR-133K3L; MOUSER_PRICE-STOCK: https://www.mouser.co.uk/ProductDetail/YAGEO/RC0402JR-133K3L?qs=fPU49sp6fCKWmtEENw96pg%3D%3D
R6 = SamacSys_Parts:RC0402FR-0793K1L: Thick Film Resistors 93.1K OHM 1% Source: Datasheet <https://www.mouser.tw/datasheet/2/447/PYu-RC_Group_51_RoHS_L_9-1314892.pdf>; DESCRIPTION: Thick Film Resistors 93.1K OHM 1%; HEIGHT: 0.4mm; MANUFACTURER_NAME: KEMET; MANUFACTURER_PART_NUMBER: RC0402FR-0793K1L; MOUSER_PART_NUMBER: 603-RC0402FR-0793K1L
R14 = SamacSys_Parts:CPF0402B1K21E1: TE Connectivity CPF Series Precision Thin Film Surface Mount Resistor 0402 Case 1.21k +/-0.1% 0.063W +/-25ppm/C Source: Datasheet; DESCRIPTION: TE Connectivity CPF Series Precision Thin Film Surface Mount Resistor 0402 Case 1.21k +/-0.1% 0.063W +/-25ppm/C; HEIGHT: 0.35mm; MANUFACTURER_NAME: TE Connectivity; MANUFACTURER_PART_NUMBER: CPF0402B1K21E1
R15 = SamacSys_Parts:ERA-2AEB7870X: Metal Thin Film Chip Resistor, 0402, 0.063W Source: Datasheet <http://industrial.panasonic.com/cdbs/www-data/pdf/RDM0000/AOA0000C307.pdf>; DESCRIPTION: Metal Thin Film Chip Resistor, 0402, 0.063W; HEIGHT: 0.4mm; MANUFACTURER_NAME: Panasonic; MANUFACTURER_PART_NUMBER: ERA-2AEB7870X
R19 = SamacSys_Parts:ERJ-2RKF2002X: Precision Thick Film Chip Resistor, 0402, 0.063W Source: Datasheet <http://industrial.panasonic.com/cdbs/www-data/pdf/RDA0000/AOA0000C304.pdf>; DESCRIPTION: Precision Thick Film Chip Resistor, 0402, 0.063W; HEIGHT: 0.4mm; MANUFACTURER_NAME: Panasonic; MANUFACTURER_PART_NUMBER: ERJ-2RKF2002X; MOUSER_PART_NUMBER: 667-ERJ-2RKF2002X; MOUSER_PRICE-STOCK: https://www.mouser.co.uk/ProductDetail/Panasonic/ERJ-2RKF2002X?qs=H7k1u0Mp9JTOxRcN%252B6dzQw%3D%3D
SPI = SamacSys_Parts:LTC6820IUD#PBF: Interface - Specialized isoSPI Iso Communications Int Source: Datasheet <https://www.analog.com/media/en/technical-documentation/data-sheets/6820fb.pdf>; DESCRIPTION: Interface - Specialized isoSPI Iso Communications Int; HEIGHT: 0.8mm; MANUFACTURER_NAME: Analog Devices; MANUFACTURER_PART_NUMBER: LTC6820IUD#PBF; MOUSER_PART_NUMBER: 584-LTC6820IUD#PBF; MOUSER_PRICE-STOCK: https://www.mouser.co.uk/ProductDetail/Analog-Devices/LTC6820IUDPBF?qs=hVkxg5c3xu96S49pvln6gg%3D%3D
TEST_CJ+ TEST_CJ- TEST_CLK TEST_CS TEST_GND1-TEST_GND4 TEST_MISO TEST_SCK = SamacSys_Parts:S1751-46R: EZ_Boardware SMT Test Point 2.0mm high S1751-46R, Brass Grounding Contact Used with Surface Mount, 3.25 x 2 x 1.65 Source: Datasheet <https://cdn.harwin.com/pdfs/S1751R.pdf>; DESCRIPTION: EZ_Boardware SMT Test Point 2.0mm high S1751-46R, Brass Grounding Contact Used with Surface Mount, 3.25 x 2 x 1.65; HEIGHT: 2mm; MANUFACTURER_NAME: Harwin; MANUFACTURER_PART_NUMBER: S1751-46R; MOUSER_PART_NUMBER: 855-S1751-46R; MOUSER_PRICE-STOCK: https://www.mouser.co.uk/ProductDetail/Harwin/S1751-46R?qs=l6ZPVqNVZb71wETAKrfRig%3D%3D
TRANSFORMER = SamacSys_Parts:782482_33VC: 1:1.33 Through Hole Telecom Transformer, 310uH, 600m Source: Datasheet <https://www.murata-ps.com/data/magnetics/kmp_782482.pdf>; DESCRIPTION: 1:1.33 Through Hole Telecom Transformer, 310uH, 600m; HEIGHT: 6.35mm; MANUFACTURER_NAME: Murata Electronics; MANUFACTURER_PART_NUMBER: 782482/33VC; MOUSER_PART_NUMBER: 580-782482/33VC; MOUSER_PRICE-STOCK: https://www.mouser.co.uk/ProductDetail/Murata-Power-Solutions/782482-33VC?qs=2G8o3QlzqXp4rFQDC5ba8Q%3D%3D
U$1-U$4 = SamacSys_Parts:THROUGH_HOLE